# EAGLE design metiumacs2 (EAGLE 7.2.0)
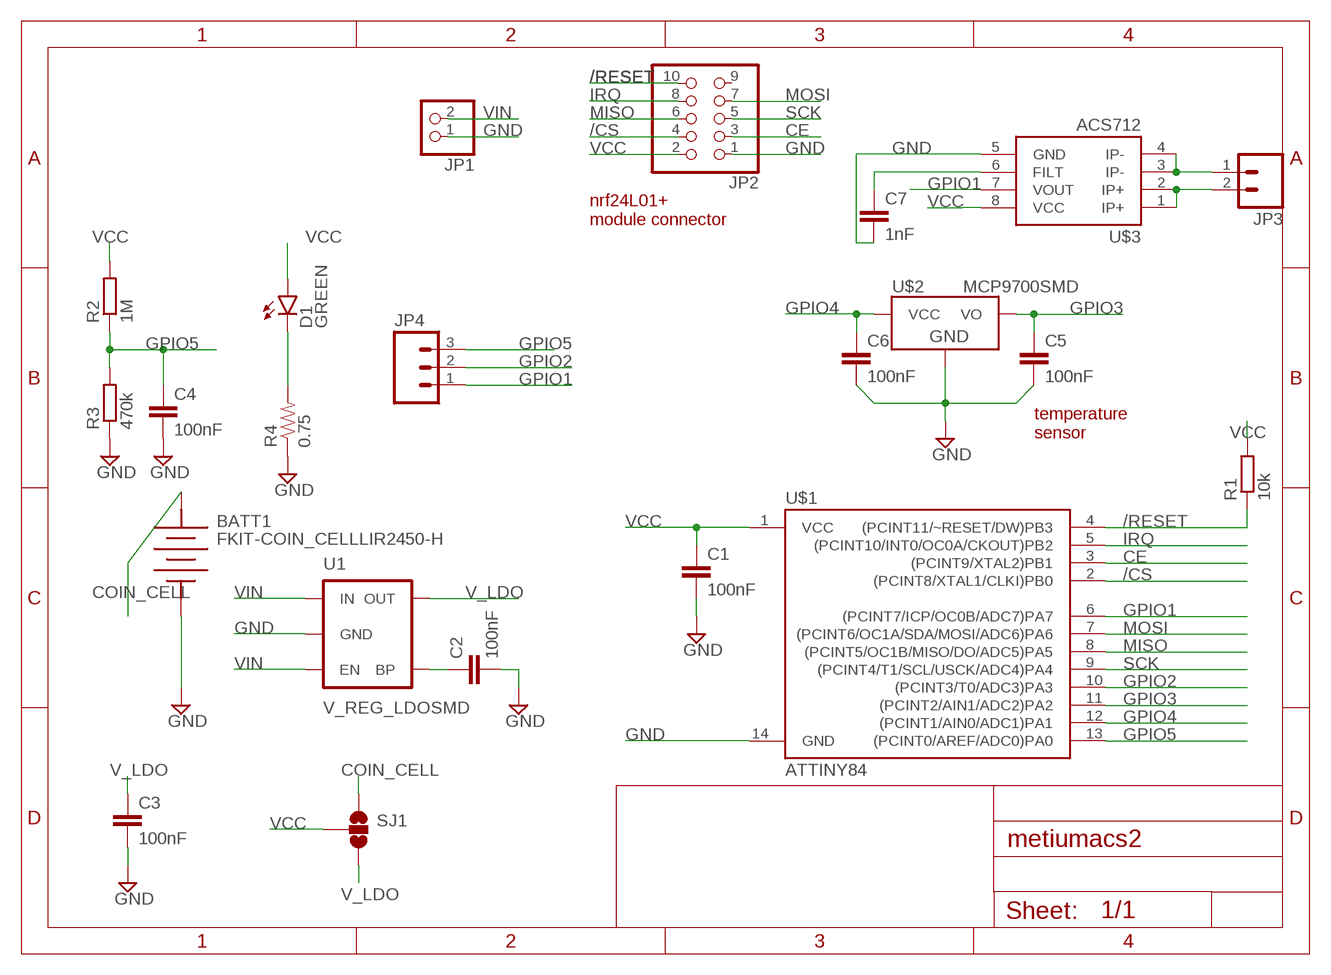
[diagram p0: schematic, sheet 1]

## Parts
BATT1  FKIT-COIN_CELLLIR2450-H  [FKIT-LIR2450-H]
C1  100nF  C-EUC0805  [C0805]
C2  100nF  C-EUC0805  [C0805]
C3  100nF  C-EUC0805  [C0805]
C4  100nF  C-EUC0805  [C0805]
C5  100nF  C-EUC0805  [C0805]
C6  100nF  C-EUC0805  [C0805]
C7  1nF  1NF/1000PF-50V-10%(0603)  [0603-CAP]
D1  GREEN  LED-GREEN0603  [LED-0603]
JP1  HEADER-1X2ROUND  [1X02_ROUND]
JP2  PINHD-2X5  [2X05M]
JP3  M02PTH4  [1X02_XTRA_BIG]
JP4  M03LONGPADS  [1X03_LONGPADS]
R1  10k  R-EU_R0805  [R0805]
R2  1M  R-EU_R0805  [R0805]
R3  470k  R-EU_R0805  [R0805]
R4  0.75  0.75OHM-1/4W-1%(0805)  [0805]
SJ1  SOLDERJUMPER_2WAYS  [SJ_3]
U1  V_REG_LDOSMD  [SOT23-5]
U$1  ATTINY84  [SO14]
U$2  MCP9700SMD  [SOT23-3]
U$3  ACS712  [SO08]

## Nets
/CS: JP2.4 U$1.2((PCINT8/XTAL1/CLKI)PB0)
/RESET: JP2.10 R1.1 U$1.4((PCINT11/~RESET/DW)PB3)
CE: JP2.3 U$1.3((PCINT9/XTAL2)PB1)
COIN_CELL: BATT1.POS SJ1.1
FS1: JP3.1 U$3.3(IP-) U$3.4(IP-)
FS2: JP3.2 U$3.1(IP+) U$3.2(IP+)
GND: BATT1.NEG C1.2 C2.2 C3.2 C4.2 C5.2 C6.2 C7.2 JP1.1 JP2.1 R3.1 R4.1 U1.2(GND) U$1.14(GND) U$2.3(GND) U$3.5(GND)
GPIO1: JP4.1 U$1.6((PCINT7/ICP/OC0B/ADC7)PA7) U$3.7(VOUT)
GPIO2: JP4.2 U$1.10((PCINT3/T0/ADC3)PA3)
GPIO3: C5.1 U$1.11((PCINT2/AIN1/ADC2)PA2) U$2.2(VO)
GPIO4: C6.1 U$1.12((PCINT1/AIN0/ADC1)PA1) U$2.1(VCC)
GPIO5: C4.1 JP4.3 R2.1 R3.2 U$1.13((PCINT0/AREF/ADC0)PA0)
IRQ: JP2.8 U$1.5((PCINT10/INT0/OC0A/CKOUT)PB2)
MISO: JP2.6 U$1.8((PCINT5/OC1B/MISO/DO/ADC5)PA5)
MOSI: JP2.7 U$1.7((PCINT6/OC1A/SDA/MOSI/ADC6)PA6)
N$1: C2.1 U1.4(BP)
N$2: C7.1 U$3.6(FILT)
N$8: D1.C R4.2
SCK: JP2.5 U$1.9((PCINT4/T1/SCL/USCK/ADC4)PA4)
V_LDO: C3.1 SJ1.3 U1.5(OUT)
VCC: C1.1 D1.A JP2.2 R1.2 R2.2 SJ1.2 U$1.1(VCC) U$3.8(VCC)
VIN: JP1.2 U1.1(IN) U1.3(EN)
Unconnected: JP2.9

## Notes on the sheet
- nrf24L01+ 
  module connector
- temperature
  sensor

## Library data of the parts
BATT1 = SparkFun-Electromechanical:FKIT-COIN_CELL: Fabrick.it Coin Cell Holder Coin cell holder for 24.5mm rechargable coin cell
C1-C6 = rcl:C-EU: CAPACITOR, European symbol
C7 = SparkFun-Capacitors:1NF/1000PF-50V-10%(0603): CAP-07886; PROD_ID: CAP-07886
D1 = SparkFun-LED:LED-GREEN: Various green LEDs Green LEDs used in SFE Production 0603- DIO-00821 LARGE- DIO-00862 LILYPAD- DIO-09910; PROD_ID: DIO-00821
JP1 = microbuilder:HEADER-1X2: PIN HEADER
JP2 = madar:PINHD-2X5: PIN HEADER
JP3 = SparkFun-Connectors:M02: Standard 2-pin 0.1" header. Use with - straight break away headers ( PRT-00116) - right angle break away headers (PRT-00553) - swiss pins (PRT-00743) - machine pins (PRT-00117) - female headers (PRT-00115) Molex polarized connector foot print use with: PRT-08233 with associated crimp pins and housings. 2.54_SCREWTERM for use with PRT-10571. 3.5mm Screw Terminal footprints for PRT-08084 5mm Screw Terminal footprints for use with PRT-08432
JP4 = SparkFun-Connectors:M03: Header 3 Standard 3-pin 0.1" header. Use with straight break away headers (SKU : PRT-00116), right angle break away headers (PRT-00553), swiss pins (PRT-00743), machine pins (PRT-00117), and female headers (PRT-00115). Molex polarized connector foot print use with SKU : PRT-08232 with associated crimp pins and housings.
R1-R3 = rcl:R-EU_: RESISTOR, European symbol
R4 = SparkFun-Resistors:0.75OHM-1/4W-1%(0805): RES-08474; PROD_ID: RES-08474
SJ1 = SparkFun-Passives:SOLDERJUMPER_2WAY: Solder Jumper 2 way solder jumper
U1 = SparkFun-PowerIC:V_REG_LDO: Voltage Regulator LDO Standard 150mA LDO voltage regulator in SOT-23 layout. Micrel part MIC5205. BP (by-pass) pin is used to lower output noise with 470pF cap.
U$1 = SparkFun-DigitalIC:ATTINY84: Atmel 14-pin 2/4/8kB flash uC
U$2 = SparkFun-Sensors:MCP9700: Analog-output temperature sensor
U$3 = SparkFun-AnalogIC:ACS712: Hall-effect-based isolated linear current sensor

## Board
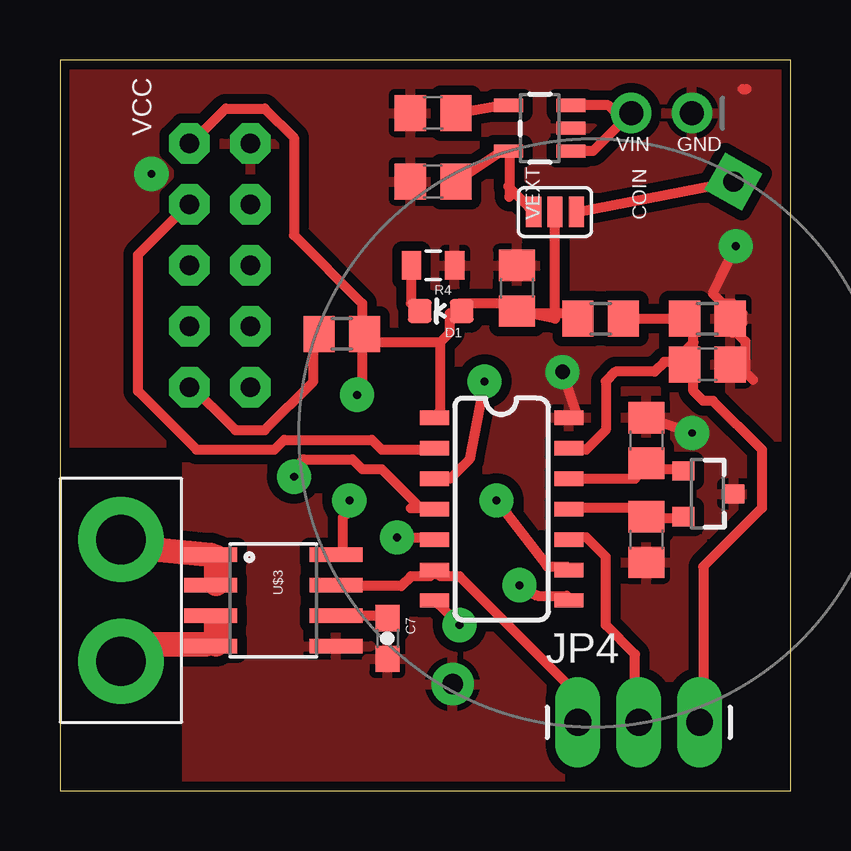
[diagram p1: board, top side]
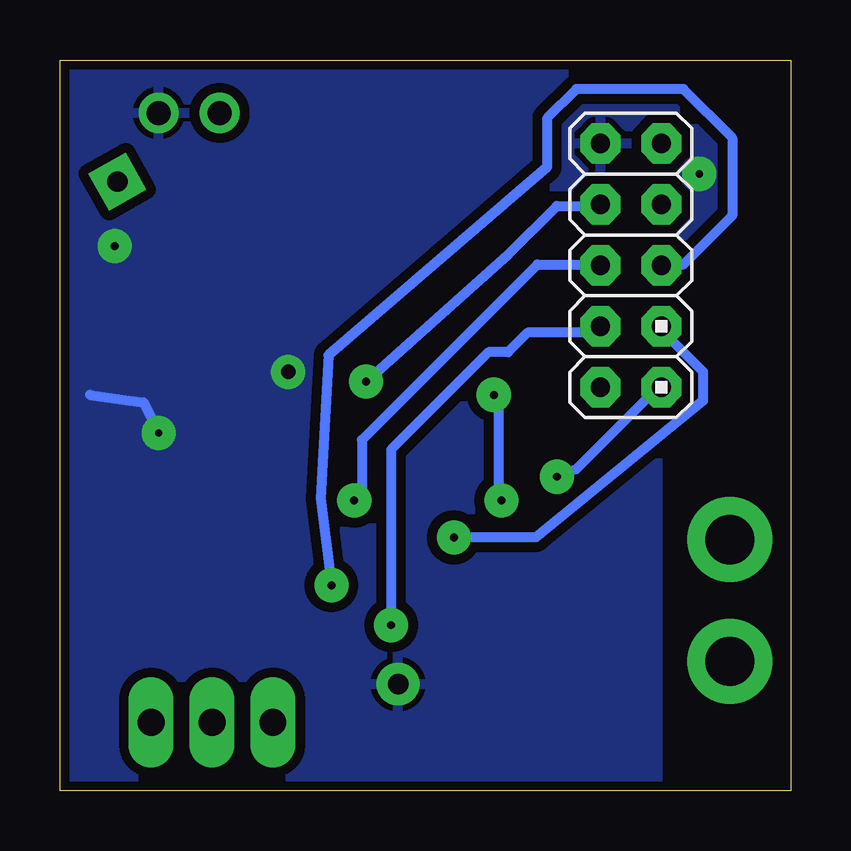
[diagram p2: board, bottom side, seen from below]

Size 30.47 x 30.47 mm. Coordinates in mm from the lower left corner, seen from the top.
Outline: 0,0 30.47,0 30.47,30.47 0,30.47 0,0
Copper layers (1*16): Top 0.0356mm / dielectric 1.5011mm / Bottom 0.0356mm
Design rules "LaenPCBOrder *": minimum track width 16mil, minimum drill 13mil, track to track 16mil, track to pad 16mil, pad to pad 16mil, via to via 16mil, smd to smd 6mil, copper to edge 15mil, drill to drill 16mil, minimum pad ring 7mil, minimum via ring 7mil, stop-mask expansion 4mil, vias tented up to drill 0mil, thermal gap 10mil
tRestrict: area 0.6,0.2 to 5.1,14.3
bRestrict: area 0.6,0.2 to 5.3,14.3

### Footprints (pad centres in the part's own frame; a part is rotated, then mirrored left to right if it is on the bottom)
FKIT-LIR2450-H = drill 0.85 pad 1.778: NEG -12,0 | drill 0.85 pad 1.778 square: POS 12,0
C0805 = smd 1.3 x 1.5: 1 -0.95,0; 2 0.95,0
0603-CAP = smd 1.1 x 1: 1 -0.85,0; 2 0.85,0
LED-0603 = smd 1 x 1: A 0,-0.877; C 0,0.877
1X02_ROUND = drill 1 pad 1.676: 1 -1.27,0; 2 1.27,0
2X05M = drill 0.8 pad 1.676 octagon: 1 -5.08,-1.27; 2 -5.08,1.27; 3 -2.54,-1.27; 4 -2.54,1.27; 5 0,-1.27; 6 0,1.27; 7 2.54,-1.27; 8 2.54,1.27; 9 5.08,-1.27; 10 5.08,1.27
1X02_XTRA_BIG = drill 2.057 pad 3.556: 1 -2.54,0; 2 2.54,0
1X03_LONGPADS = drill 1.118 pad 1.88 long: 1 0,0; 2 2.54,0; 3 5.08,0
R0805 = smd 1.3 x 1.5: 1 -0.95,0; 2 0.95,0
0805 = smd 0.8 x 1.2: 1 -0.9,0; 2 0.9,0
SJ_3 = smd 0.635 x 1.27: 1 -0.889,0; 2 0,0; 3 0.889,0
SOT23-5 = smd 0.55 x 1.2: 1 -0.95,-1.3; 2 0,-1.3; 3 0.95,-1.3; 4 0.95,1.3; 5 -0.95,1.3
SO14 = smd 0.6 x 1.2: 1 -3.81,-2.8; 2 -2.54,-2.8; 3 -1.27,-2.8; 4 0,-2.8; 5 1.27,-2.8; 6 2.54,-2.8; 7 3.81,-2.8; 8 3.81,2.8; 9 2.54,2.8; 10 1.27,2.8; 11 0,2.8; 12 -1.27,2.8; 13 -2.54,2.8; 14 -3.81,2.8
SOT23-3 = smd 0.8 x 0.9: 1 -0.95,-1; 2 0.95,-1; 3 0,1.1
SO08 = smd 0.61 x 2.21: 1 -1.905,-2.616; 2 -0.635,-2.616; 3 0.635,-2.616; 4 1.905,-2.616; 5 1.905,2.616; 6 0.635,2.616; 7 -0.635,2.616; 8 -1.905,2.616

### Placement (x,y rotation side)
BATT1  22.23,14.92 60.8 top
C1  19.05,20.95 90 top
C2  15.56,28.26 180 top
C3  15.56,25.4 180 top
C4  26.99,17.78 0 top
C5  24.45,10.48 270 top
C6  24.45,14.61 90 top
C7  13.65,6.35 270 top
D1  15.88,20 90 top
JP1  25.08,28.26 180 top
JP2  6.67,21.91 270 bottom
JP3  2.54,7.94 90 top
JP4  21.59,2.86 0 top
R1  11.75,19.05 0 top
R2  22.54,19.68 180 top
R3  26.99,19.68 180 top
R4  15.56,21.91 180 top
SJ1  20.64,24.13 180 top
U1  20,27.62 90 top
U$1  18.41,11.75 270 top
U$2  26.99,12.38 270 top
U$3  8.89,7.94 270 top

### Tracks (layer width: path | path; a pad name or v marks a point on that pad's centre or on a via)
/CS
  Top 0.406: JP2.4 5.28,24.38 3.25,22.35 3.25,16.66 5.69,14.22 8.94,14.22 9.35,14.63 13.01,14.63 13.41,14.22 15.44,14.22 U$1.2
/RESET  (via drill 0.33 pad 1.42)
  Top 0.406: JP2.10 5.28,17.07 7.32,15.04 8.53,15.04 10.57,17.07 10.57,18.69 R1.1 | 14.63,11.79 15.04,11.79 | 15.04,11.79 15.44,11.79 U$1.4 15.04,11.79 | 15.04,11.79 13.41,13.41 12.6,13.41 12.19,13.82 10.16,13.82 9.75,13.41 v9.75,13.09
  Bottom 0.406: 5.28,17.07 JP2.10 5.69,16.66 8.94,13.41 v9.75,13.09
CE  (via drill 0.33 pad 1.42)
  Top 0.406: U$1.3 15.85,13.01 16.26,13.01 17.07,13.82 v17.7,17.07
  Bottom 0.406: v17.7,17.07 11.79,22.35 9.75,24.38 8.13,24.38 JP2.3
COIN_CELL
  Top 0.406: SJ1.1 BATT1.POS
FS1
  Top 0.406: 3.25,6.1 2.85,5.69 JP3.1 | 6.1,6.1 U$3.4 6.5,6.1 | 6.5,7.11 U$3.3
  Top 1.016: 3.25,6.1 6.1,6.1 | 6.5,6.1 6.5,7.11
FS2
  Top 0.406: 2.85,10.16 JP3.2 | 6.5,8.64 U$3.2 | 6.5,9.75 U$3.1
  Top 1.016: 2.85,10.16 U$3.1 | 6.5,9.75 6.5,8.64
GND  (via drill 0.3 pad 1.42, 0.33 pad 1.42, 0.6 pad 1.42)
  Top 0.406: 28.45,29.26 28.62,29.26 | U1.2 21.13,27.64 21.13,27.62 | v20.95,17.46 21.59,15.56 U$1.14 | 28.45,19.51 28.38,19.56 | 28.26,18.1 C4.2 28.04,18.29 | R3.1 28.26,19.68 28.26,19.56 | 28.04,19.1 R3.1 | v28.18,22.71 27.23,20.73 27.64,20.32 28.04,20.32 28.45,19.91 28.45,19.51 | 28.45,19.51 R3.1 | 28.04,19.51 R3.1 | C6.2 v26.35,14.92 26.67,15.24 | 28.89,17.14 28.57,17.46 28.57,18.73 28.26,19.05 R3.1 | U$1.14 21.13,15.44 U$1.14
  Bottom 0.406: v26.35,14.92 26.99,16.19 29.21,16.51
  other vias: 3.81,25.72
  pour Top: -0.32,-0.32 30.8,-0.32 30.8,30.8 -0.32,30.8
  pour Bottom: 0,0 30.48,0 30.48,30.48 0,30.48
GPIO1
  Top 0.406: 21.54,4.06 21.54,3.25 JP4.1 | 21.54,2.85 JP4.1 | 21.54,4.06 16.66,8.94 15.85,8.94 U$1.6 15.44,8.94 14.63,8.94 14.22,8.53 11.79,8.53 U$3.7 | 21.54,4.06 JP4.1
GPIO2
  Top 0.406: U$1.10 21.54,10.57 21.95,10.57 22.76,9.75 22.76,6.91 23.98,5.69 23.98,3.25 JP4.2
GPIO3
  Top 0.406: U$2.2 25.6,11.38 24.79,11.38 C5.1 24.38,11.79 21.54,11.79 U$1.11
GPIO4
  Top 0.406: U$2.1 25.6,13.41 24.79,13.41 C6.1 23.98,13.01 21.54,13.01 U$1.12
GPIO5
  Top 0.406: R2.1 R3.2 26.42,19.51 26.42,18.69 | 26.42,18.69 26.42,17.88 C4.1 | 26.42,18.69 25.6,17.88 25.2,17.88 24.79,17.48 23.16,17.48 22.76,17.07 22.76,15.04 21.95,14.22 21.54,14.22 U$1.13 | JP4.3 26.82,3.25 26.82,9.35 29.26,11.79 29.26,14.22 27.23,16.26 26.82,16.26 26.42,16.66 26.42,17.48 C4.1 | 26.01,17.48 C4.1
IRQ  (via drill 0.33 pad 1.42)
  Top 0.406: v14.05,10.57 15.44,10.57 U$1.5
  Bottom 0.406: v14.05,10.57 10.62,10.57 3.66,16.26 3.66,17.48 5.28,19.1 JP2.8
MISO  (via drill 0.33 pad 1.42)
  Top 0.406: v19.15,8.57 19.91,8.13 21.13,8.13 U$1.8
  Bottom 0.406: v19.15,8.57 19.6,12.19 19.28,18.16 10.16,26.01 10.16,28.04 8.94,29.26 4.47,29.26 2.44,27.23 2.44,23.98 4.47,21.95 5.28,21.95 JP2.6
MOSI  (via drill 0.33 pad 1.42)
  Top 0.406: v16.66,6.91 15.85,7.72 U$1.7
  Bottom 0.406: JP2.7 8.13,19.1 10.97,19.1 11.79,18.29 12.6,18.29 16.66,14.22 v16.66,6.91
N$1
  Top 0.406: C2.1 18.41,28.57 U1.4
N$2
  Top 0.406: C7.1 13.41,7.32 11.79,7.32 U$3.6
N$8
  Top 0.406: D1.C 14.63,20.32 14.63,21.54 R4.2
SCK  (via drill 0.33 pad 1.42)
  Top 0.406: v18.2,12.1 20.32,9.35 21.13,9.35 U$1.9
  Bottom 0.406: 8.53,21.95 8.13,21.95 JP2.5 8.53,21.95 | 8.53,21.95 10.57,21.95 17.88,14.63 17.88,12.19 v18.2,12.1
V_LDO
  Top 0.406: C3.1 18.41,26.67 U1.5 18.73,26.67 18.73,25.2 | 18.73,25.2 18.73,24.77 | SJ1.3 19.51,24.38 18.69,25.2 18.73,25.2
VCC  (via drill 0.33 pad 1.42)
  Top 0.406: C1.1 20.64,19.68 SJ1.2 | R2.2 21.54,19.91 19.1,19.91 C1.1 | JP2.2 5.69,27.23 6.91,28.45 8.53,28.45 9.75,27.23 9.75,23.16 12.6,20.32 12.6,19.1 R1.2 | C1.1 18.69,20.32 16.66,20.32 D1.A 16.26,19.91 16.26,19.1 15.85,18.69 | 15.44,15.44 U$1.1 15.85,15.85 15.85,18.69 | 13.01,19.1 R1.2 | 15.85,18.69 13.01,18.69 R1.2 | v12.38,16.51 12.6,16.66 12.6,18.69 R1.2 | U$3.8 11.79,9.75 11.79,11.38 12.19,11.79 v12.06,12.1
  Bottom 0.406: 12.19,12.19 12.19,11.79 | 12.19,12.19 12.19,16.26 v12.38,16.51 | 12.19,12.19 v12.06,12.1
VIN
  Top 0.406: 23.5,27.94 22.23,26.67 21.59,26.67 U1.1 | 23.5,27.94 22.86,28.57 21.59,28.57 U1.3 | 23.5,27.94 JP1.2

### Text on the board
tNames: VCC | VIN | GND | VEXT | COIN